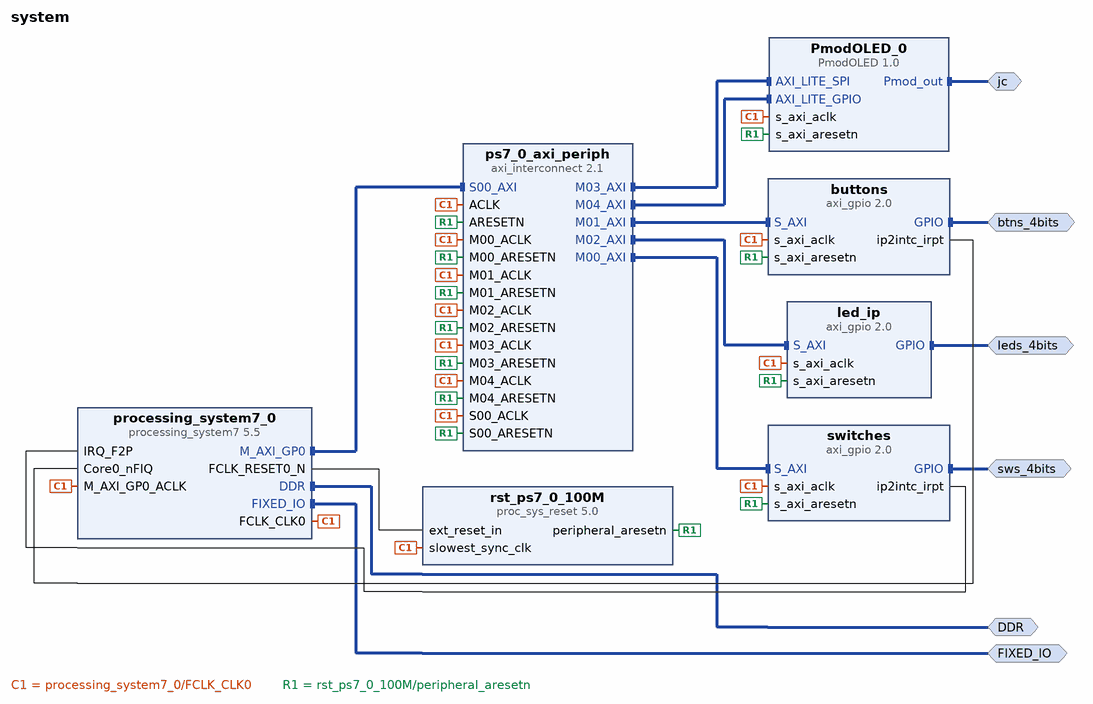
[diagram p0: block diagram of the top level]
# Vivado block design system, xc7z020clg400-1, Vivado 2019.1
create_bd_design system

create_bd_intf_port -mode Master -vlnv xilinx.com:interface:ddrx_rtl:1.0 DDR
create_bd_intf_port -mode Master -vlnv xilinx.com:display_processing_system7:fixedio_rtl:1.0 FIXED_IO
create_bd_intf_port -mode Master -vlnv xilinx.com:interface:gpio_rtl:1.0 sws_4bits
create_bd_intf_port -mode Master -vlnv xilinx.com:interface:gpio_rtl:1.0 btns_4bits
create_bd_intf_port -mode Master -vlnv xilinx.com:interface:gpio_rtl:1.0 leds_4bits
create_bd_intf_port -mode Master -vlnv digilentinc.com:interface:pmod_rtl:1.0 jc

create_bd_cell -type ip -vlnv xilinx.com:ip:processing_system7:5.5 processing_system7_0
set_property -dict [list \
  CONFIG.PCW_APU_PERIPHERAL_FREQMHZ 666.666666 \
  CONFIG.PCW_CORE0_FIQ_INTR 1 \
  CONFIG.PCW_ENET0_PERIPHERAL_ENABLE 0 \
  CONFIG.PCW_FCLK_CLK0_BUF FALSE \
  CONFIG.PCW_FPGA0_PERIPHERAL_FREQMHZ 100 \
  CONFIG.PCW_GPIO_MIO_GPIO_ENABLE 0 \
  CONFIG.PCW_IRQ_F2P_INTR 1 \
  CONFIG.PCW_PRESET_BANK1_VOLTAGE {LVCMOS 1.8V} \
  CONFIG.PCW_QSPI_PERIPHERAL_ENABLE 0 \
  CONFIG.PCW_SD0_PERIPHERAL_ENABLE 0 \
  CONFIG.PCW_UART1_PERIPHERAL_ENABLE 1 \
  CONFIG.PCW_UART1_UART1_IO {MIO 48 .. 49} \
  CONFIG.PCW_UART_PERIPHERAL_FREQMHZ 100 \
  CONFIG.PCW_UIPARAM_DDR_FREQ_MHZ 533.333333 \
  CONFIG.PCW_UIPARAM_DDR_MEMORY_TYPE {DDR 3 (Low Voltage)} \
  CONFIG.PCW_UIPARAM_DDR_PARTNO {MT41K256M16 RE-125} \
  CONFIG.PCW_USB0_PERIPHERAL_ENABLE 0 \
  CONFIG.PCW_USE_FABRIC_INTERRUPT 1 \
] [get_bd_cells processing_system7_0]
# 146 more settings of processing_system7_0 are not shown: defaults, MIO pin electricals, DDR timing, and values the tool derives
create_bd_cell -type ip -vlnv xilinx.com:ip:axi_gpio:2.0 switches
set_property -dict [list \
  CONFIG.C_INTERRUPT_PRESENT 1 \
  CONFIG.GPIO_BOARD_INTERFACE sws_4bits \
  CONFIG.USE_BOARD_FLOW true \
] [get_bd_cells switches]
create_bd_cell -type ip -vlnv xilinx.com:ip:axi_interconnect:2.1 ps7_0_axi_periph
set_property -dict {CONFIG.NUM_MI 5} [get_bd_cells ps7_0_axi_periph]
create_bd_cell -type ip -vlnv xilinx.com:ip:proc_sys_reset:5.0 rst_ps7_0_100M
create_bd_cell -type ip -vlnv xilinx.com:ip:axi_gpio:2.0 buttons
set_property -dict [list \
  CONFIG.C_INTERRUPT_PRESENT 1 \
  CONFIG.GPIO_BOARD_INTERFACE btns_4bits \
  CONFIG.USE_BOARD_FLOW true \
] [get_bd_cells buttons]
create_bd_cell -type ip -vlnv xilinx.com:ip:axi_gpio:2.0 led_ip
set_property -dict {CONFIG.GPIO_BOARD_INTERFACE leds_4bits CONFIG.USE_BOARD_FLOW true} [get_bd_cells led_ip]
create_bd_cell -type ip -vlnv digilentinc.com:IP:PmodOLED:1.0 PmodOLED_0
set_property -dict {CONFIG.PMOD jc CONFIG.USE_BOARD_FLOW true} [get_bd_cells PmodOLED_0]

# ---- connections ----

connect_bd_intf_net [get_bd_intf_pins ps7_0_axi_periph/M03_AXI] [get_bd_intf_pins PmodOLED_0/AXI_LITE_SPI]
connect_bd_intf_net [get_bd_intf_pins ps7_0_axi_periph/M04_AXI] [get_bd_intf_pins PmodOLED_0/AXI_LITE_GPIO]
connect_bd_intf_net [get_bd_intf_ports jc] [get_bd_intf_pins PmodOLED_0/Pmod_out]
connect_bd_intf_net [get_bd_intf_ports DDR] [get_bd_intf_pins processing_system7_0/DDR]
connect_bd_intf_net [get_bd_intf_ports leds_4bits] [get_bd_intf_pins led_ip/GPIO]
connect_bd_intf_net [get_bd_intf_pins ps7_0_axi_periph/M00_AXI] [get_bd_intf_pins switches/S_AXI]
connect_bd_intf_net [get_bd_intf_pins ps7_0_axi_periph/M02_AXI] [get_bd_intf_pins led_ip/S_AXI]
connect_bd_intf_net [get_bd_intf_pins ps7_0_axi_periph/M01_AXI] [get_bd_intf_pins buttons/S_AXI]
connect_bd_intf_net -intf_net axi_gpio_0_GPIO [get_bd_intf_ports btns_4bits] [get_bd_intf_pins buttons/GPIO]
connect_bd_intf_net [get_bd_intf_ports sws_4bits] [get_bd_intf_pins switches/GPIO]
connect_bd_intf_net [get_bd_intf_ports FIXED_IO] [get_bd_intf_pins processing_system7_0/FIXED_IO]
connect_bd_intf_net [get_bd_intf_pins processing_system7_0/M_AXI_GP0] [get_bd_intf_pins ps7_0_axi_periph/S00_AXI]
connect_bd_net [get_bd_pins processing_system7_0/FCLK_CLK0] \
  [get_bd_pins processing_system7_0/M_AXI_GP0_ACLK] [get_bd_pins ps7_0_axi_periph/S00_ACLK] \
  [get_bd_pins rst_ps7_0_100M/slowest_sync_clk] [get_bd_pins switches/s_axi_aclk] [get_bd_pins ps7_0_axi_periph/M00_ACLK] \
  [get_bd_pins ps7_0_axi_periph/ACLK] [get_bd_pins buttons/s_axi_aclk] [get_bd_pins ps7_0_axi_periph/M01_ACLK] \
  [get_bd_pins led_ip/s_axi_aclk] [get_bd_pins ps7_0_axi_periph/M02_ACLK] [get_bd_pins PmodOLED_0/s_axi_aclk] \
  [get_bd_pins ps7_0_axi_periph/M03_ACLK] [get_bd_pins ps7_0_axi_periph/M04_ACLK]
connect_bd_net [get_bd_pins processing_system7_0/FCLK_RESET0_N] [get_bd_pins rst_ps7_0_100M/ext_reset_in]
connect_bd_net [get_bd_pins rst_ps7_0_100M/peripheral_aresetn] \
  [get_bd_pins ps7_0_axi_periph/S00_ARESETN] [get_bd_pins switches/s_axi_aresetn] [get_bd_pins ps7_0_axi_periph/M00_ARESETN] \
  [get_bd_pins ps7_0_axi_periph/ARESETN] [get_bd_pins buttons/s_axi_aresetn] [get_bd_pins ps7_0_axi_periph/M01_ARESETN] \
  [get_bd_pins led_ip/s_axi_aresetn] [get_bd_pins ps7_0_axi_periph/M02_ARESETN] [get_bd_pins PmodOLED_0/s_axi_aresetn] \
  [get_bd_pins ps7_0_axi_periph/M03_ARESETN] [get_bd_pins ps7_0_axi_periph/M04_ARESETN]
connect_bd_net [get_bd_pins switches/ip2intc_irpt] [get_bd_pins processing_system7_0/IRQ_F2P]
connect_bd_net [get_bd_pins buttons/ip2intc_irpt] [get_bd_pins processing_system7_0/Core0_nFIQ]

# ---- address map ----
assign_bd_address -offset 0x40000000 -range 64K -target_address_space [get_bd_addr_spaces processing_system7_0/Data] [get_bd_addr_segs PmodOLED_0/AXI_LITE_SPI/Reg0]
assign_bd_address -offset 0x40010000 -range 4K -target_address_space [get_bd_addr_spaces processing_system7_0/Data] [get_bd_addr_segs PmodOLED_0/AXI_LITE_GPIO/Reg0]
assign_bd_address -offset 0x41200000 -range 64K -target_address_space [get_bd_addr_spaces processing_system7_0/Data] [get_bd_addr_segs switches/S_AXI/Reg]
assign_bd_address -offset 0x41210000 -range 64K -target_address_space [get_bd_addr_spaces processing_system7_0/Data] [get_bd_addr_segs buttons/S_AXI/Reg]
assign_bd_address -offset 0x41220000 -range 64K -target_address_space [get_bd_addr_spaces processing_system7_0/Data] [get_bd_addr_segs led_ip/S_AXI/Reg]

validate_bd_design
save_bd_design
